# Altium project ST-Link.PrjPCB
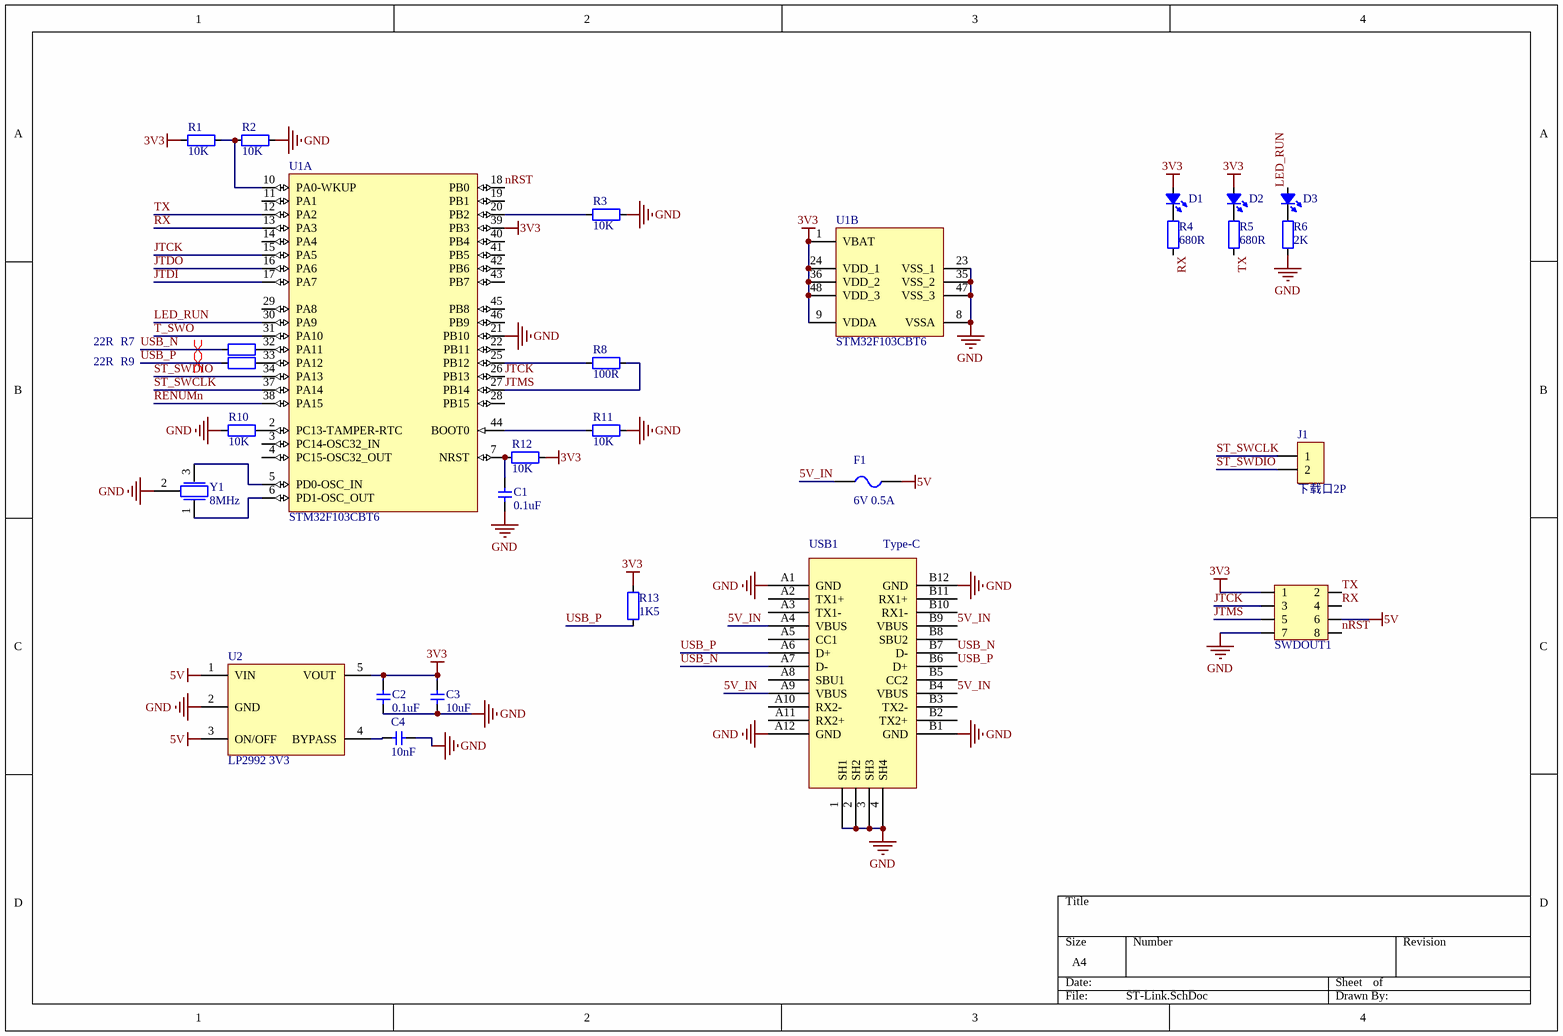
[diagram p0: ST-Link.SchDoc]
1 sheet, 27 parts. Net scope: global (net labels, ports and power ports of the same name join across sheets).
Board file: ST-Link.PcbDoc

## Sheet ST-Link.SchDoc
size A4; SheetNumber: 1; SheetTotal: 1

### Parts
C1  0.1uF  [0603_CAP]
C2  0.1uF  [0603_CAP]
C3  10uF  [0603_CAP]
C4  10nF  [0603_CAP]
D1  LED-0603  [0603_LED_RED]  (value not drawn)
D2  LED-0603  [0603_LED_RED]  (value not drawn)
D3  LED-0603  [0603_LED_RED]  (value not drawn)
F1  6V 0.5A  [FU 0805]
J1  下载口2P  [下载口2P-1.27]
R1  10K  [0603_RES]
R2  10K  [0603_RES]
R3  10K  [0603_RES]
R4  680R  [0603_RES]
R5  680R  [0603_RES]
R6  2K  [0603_RES]
R7  22R  [0603_RES]
R8  100R  [0603_RES]
R9  22R  [0603_RES]
R10  10K  [0603_RES]
R11  10K  [0603_RES]
R12  10K  [0603_RES]
R13  1K5  [0603_RES]
SWDOUT1  HDR2x4_2.54  [HDR2X4_2.54_180H]  (value not drawn)
U1  STM32F103CBT6  [LQFP-48]  (parts A,B of 2)
U2  LP2992 3V3  [SOT23-5]
USB1  Type-C  [Type-C-TOP]
Y1  8MHz  [晶振-3P]

### Nets
3V3: C2.2 C3.2 D1.1(A) D2.1(A) R1.1 R12.2 R13.2 SWDOUT1.1 U1.1(VBAT) U1.9(VDDA) U1.24(VDD_1) U1.36(VDD_2) U1.39(PB3) U1.48(VDD_3) U2.5(VOUT)
5V: F1.2 SWDOUT1.6 U2.1(VIN) U2.3(ON/OFF)
GND: C1.1 C2.1 C3.1 C4.1 R2.2 R3.2 R6.1 R10.1 R11.2 SWDOUT1.7 U1.8(VSSA) U1.21(PB10) U1.23(VSS_1) U1.35(VSS_2) U1.47(VSS_3) U2.2(GND) USB1.1(SH1) USB1.2(SH2) USB1.3(SH3) USB1.4(SH4) USB1.A1(GND) USB1.A12(GND) USB1.B1(GND) USB1.B12(GND) Y1.2
5V_IN: F1.1 USB1.A4(VBUS) USB1.A9(VBUS) USB1.B4(VBUS) USB1.B9(VBUS)
JTCK: SWDOUT1.3 U1.15(PA5) U1.26(PB13)
JTDI: U1.17(PA7)
JTDO: U1.16(PA6)
JTMS: R8.2 SWDOUT1.5 U1.27(PB14)
LED_RUN: D3.1(A) U1.30(PA9)
nRST: SWDOUT1.8 U1.18(PB0)
RENUMn: U1.38(PA15)
RX: R4.1 SWDOUT1.4 U1.13(PA3)
ST_SWCLK: J1.1 U1.37(PA14)
ST_SWDIO: J1.2 U1.34(PA13)
T_SWO: U1.31(PA10)
TX: R5.1 SWDOUT1.2 U1.12(PA2)
USB_N: R7.1 USB1.A7(D-) USB1.B7(D-)
USB_P: R9.1 R13.1 USB1.A6(D+) USB1.B6(D+)
NetC1_2: C1.2 R12.1 U1.7(NRST)
NetC4_2: C4.2 U2.4(BYPASS)
NetD1_2: D1.2(K) R4.2
NetD2_2: D2.2(K) R5.2
NetD3_2: D3.2(K) R6.2
NetR1_2: R1.2 R2.1 U1.10(PA0-WKUP)
NetR3_1: R3.1 U1.20(PB2)
NetR7_2: R7.2 U1.32(PA11)
NetR8_1: R8.1 U1.25(PB12)
NetR9_2: R9.2 U1.33(PA12)
NetR10_2: R10.2 U1.2(PC13-TAMPER-RTC)
NetR11_1: R11.1 U1.44(BOOT0)
NetU1_5: U1.5(PD0-OSC_IN) Y1.3
NetU1_6: U1.6(PD1-OSC_OUT) Y1.1

Not connected (* = marked no-connect by the designer): U1 3(PC14-OSC32_IN) 4(PC15-OSC32_OUT) 11(PA1) 14(PA4) 19(PB1) 22(PB11) 28(PB15) 29(PA8) 40(PB4) 41(PB5) 42(PB6) 43(PB7) 45(PB8) 46(PB9); USB1 A2(TX1+) A3(TX1-) A5(CC1) A8(SBU1) A10(RX2-) A11(RX2+) B2(TX2+) B3(TX2-) B5(CC2) B8(SBU2) B10(RX1-) B11(RX1+)

### Layout directives
differential pair: USB_N, USB_P

### Library data of the parts
C1-C4 = 电容-0603: 电容; Value: 0.1u
D1-D3 = 二极管-0603-RED: 发光二极管
F1 = FU: 贴片保险丝; 版权归属: 封装库来自淘宝卖家 ID：黄晶宝石; BOM名称: 贴片保险丝; 学习资源: https://shop463601444.taobao.com
J1 = 接插件-下载口2P: 下载口2P SWD
R1-R13 = 电阻-0603: 电阻
  R1-R3 R10-R12: Value: 10K
  R4 R5: Value: 680R
  R6: Value: 2K
  R7 R9: Value: 22R
  R8: Value: 100R
  R13: Value: 1K5
SWDOUT1 = HDR2x4_2.54: Header
U1 = STM32F103CBT6: ARM Cortex-M3 32-bit MCU, 128 KB Flash, 20 KB Internal RAM, 37 I/Os, 48-pin LQFP, -40 to 85 degC, Tray; A/D Converter: 2x12-bit (10 Channel); FLASH Size (Prog) (kB): 128; I/Os (High Current): 37; Internal RAM Size (kB): 20; Operating Frequency(F) (Processor speed) (MHz): 72; Supply Voltage(Vcc) min (V): 2; DatasheetVersion: Rev. 16; PackageVersion: Rev. 6, 06/2013; PackageReference: LQFP48; PackageDescription: 48-Pin Low Profile Quad Flat Package, 7 x 7 mm Body, 0.5 mm Pitch; Supplier 1: Digi-Key; Supplier Part Number 1: 497-6288-ND; Supplier 2: Farnell; Supplier Part Number 2: 1606327; Core: ARM Cortex-M3; Packing: Tray; Mounting Technology: Surface Mount; PartNumber: STM32F103CBT6; ComponentLink1Description: Manufacturer URL; ComponentLink1URL: http://www.st.com/web/en/home.html; ComponentLink2Description: Datasheet; ComponentLink2URL: http://www.st.com/st-web-ui/static/active/en/resource/technical/document/datasheet/CD00161566.pdf; ComponentLink3Description: Package Specification; ComponentLink3URL: http://www.st.com/st-web-ui/static/active/en/resource/technical/document/datasheet/DM00058181.pdf; Supplier 3: Newark; Supplier Part Number 3: 11N8296; Supplier 4: Newark; Supplier Part Number 4: 57P1214; Supplier 5: Mouser; Supplier Part Number 5: 511-STM32F103CBT6
U2 = LP2992: LDO
USB1 = USB-Type-C-TOP
Y1 = 晶振-3Pin: 村田贴片